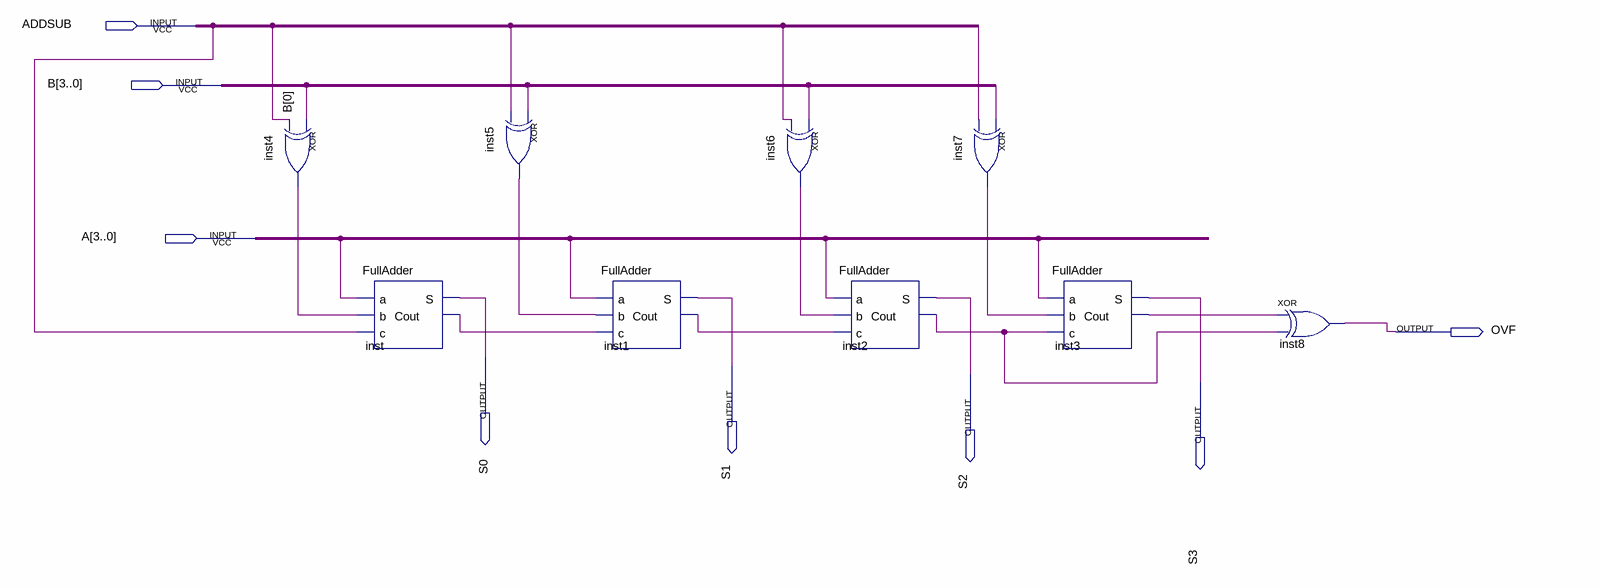
[diagram p0: schematic sheet]
// Quartus schematic AddSubDemo.bdf as structural Verilog: 9 symbols, 8 pins
module AddSubDemo (
  input  ADDSUB,
  input  [3:0] B,
  input  [3:0] A,
  output OVF,
  output S0,
  output S1,
  output S2,
  output S3
);

  wire inst1_cout, inst2_cout, inst3_cout, inst4_out, inst5_out, inst6_out, inst7_out, inst_cout, undriven,
       undriven_2, undriven_3, undriven_4, undriven_5, undriven_6, undriven_7;

  xor inst4 (inst4_out, B[0], ADDSUB);
  FullAdder inst (.a(undriven_4), .b(inst4_out), .c(ADDSUB), .S(S0), .Cout(inst_cout));
  xor inst5 (inst5_out, undriven_5, ADDSUB);
  FullAdder inst1 (.a(undriven_3), .b(inst5_out), .c(inst_cout), .S(S1), .Cout(inst1_cout));
  xor inst6 (inst6_out, undriven_6, ADDSUB);
  FullAdder inst2 (.a(undriven_2), .b(inst6_out), .c(inst1_cout), .S(S2), .Cout(inst2_cout));
  xor inst7 (inst7_out, undriven_7, ADDSUB);
  FullAdder inst3 (.a(undriven), .b(inst7_out), .c(inst2_cout), .S(S3), .Cout(inst3_cout));
  xor inst8 (OVF, inst3_cout, inst2_cout);
endmodule
